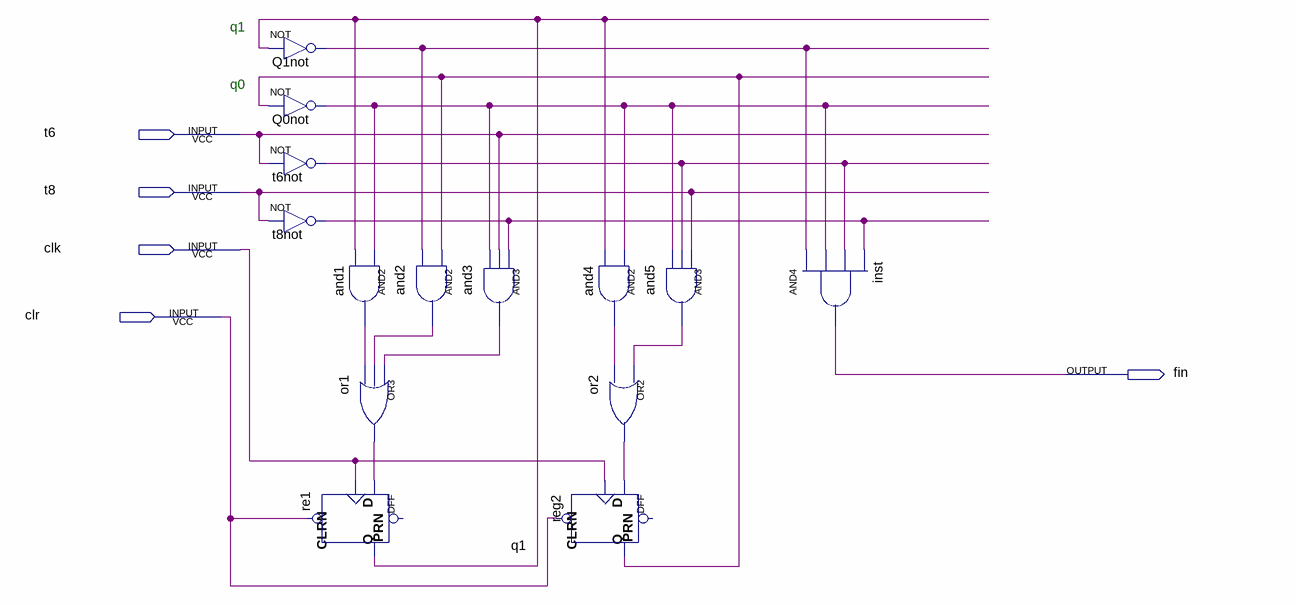
[diagram p0: schematic sheet]
// Quartus schematic T6_8.bdf as structural Verilog: 14 symbols, 5 pins
module T6_8 (
  input  t6,
  input  t8,
  input  clk,
  input  clr,
  output fin
);

  wire and1_out, and2_out, and3_out, and4_out, and5_out, or1_out, or2_out, Q0not_out, q1, Q1not_out, reg2_q,
       t6not_out, t8not_out;

  not Q1not (Q1not_out, q1);
  not Q0not (Q0not_out, reg2_q);
  not t6not (t6not_out, t6);
  not t8not (t8not_out, t8);
  and and1 (and1_out, Q0not_out, q1);
  or or1 (or1_out, and3_out, and2_out, and1_out);
  DFF re1 (.CLRN(clr), .CLK(clk), .D(or1_out), .Q(q1));  // open: PRN
  and and2 (and2_out, reg2_q, Q1not_out);
  and and3 (and3_out, t8not_out, t6, Q0not_out);
  and and4 (and4_out, Q0not_out, q1);
  or or2 (or2_out, and5_out, and4_out);
  DFF reg2 (.CLRN(clr), .CLK(clk), .D(or2_out), .Q(reg2_q));  // open: PRN
  and and5 (and5_out, t8, t6not_out, Q0not_out);
  and inst (fin, Q1not_out, Q0not_out, t6not_out, t8not_out);

  // Notes on the sheet:
  //   q1
  //   q0
endmodule
